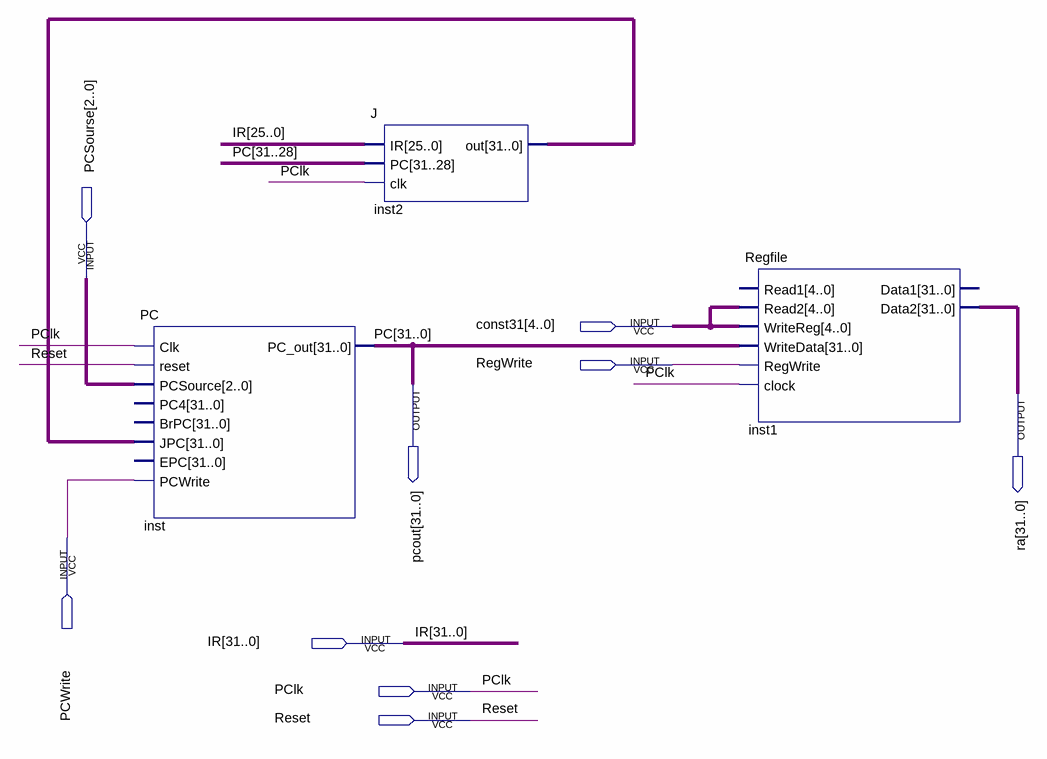
[diagram p0: schematic sheet]
// Quartus schematic jump.bdf as structural Verilog: 3 symbols, 9 pins
module jump (
  input  [2:0] PCSourse,
  input  [4:0] const31,
  input  RegWrite,
  input  PCWrite,
  input  [31:0] IR,
  input  PClk,
  input  Reset,
  output [31:0] pcout,
  output [31:0] ra
);

  wire [31:0] inst2_out;

  PC inst (
    .Clk(PClk), .reset(Reset), .PCSource(PCSourse), .JPC(inst2_out), .PCWrite(PCWrite), .PC_out(pcout));  // open: PC4, BrPC, EPC
  J inst2 (.IR(IR[25:0]), .PC(pcout[31:28]), .clk(PClk), .out(inst2_out));
  Regfile inst1 (
    .Read2(const31), .WriteReg(const31), .WriteData(pcout), .RegWrite(RegWrite), .clock(PClk), .Data2(ra));  // open: Read1, Data1

  // Other names for the same wires on the sheet: PC[31:0] = pcout
endmodule
